# EAGLE schematic IR_CHR_LINSW_J002947Arevs (EAGLE 6.4), part 2 of 2
## Sheet 5 of 5
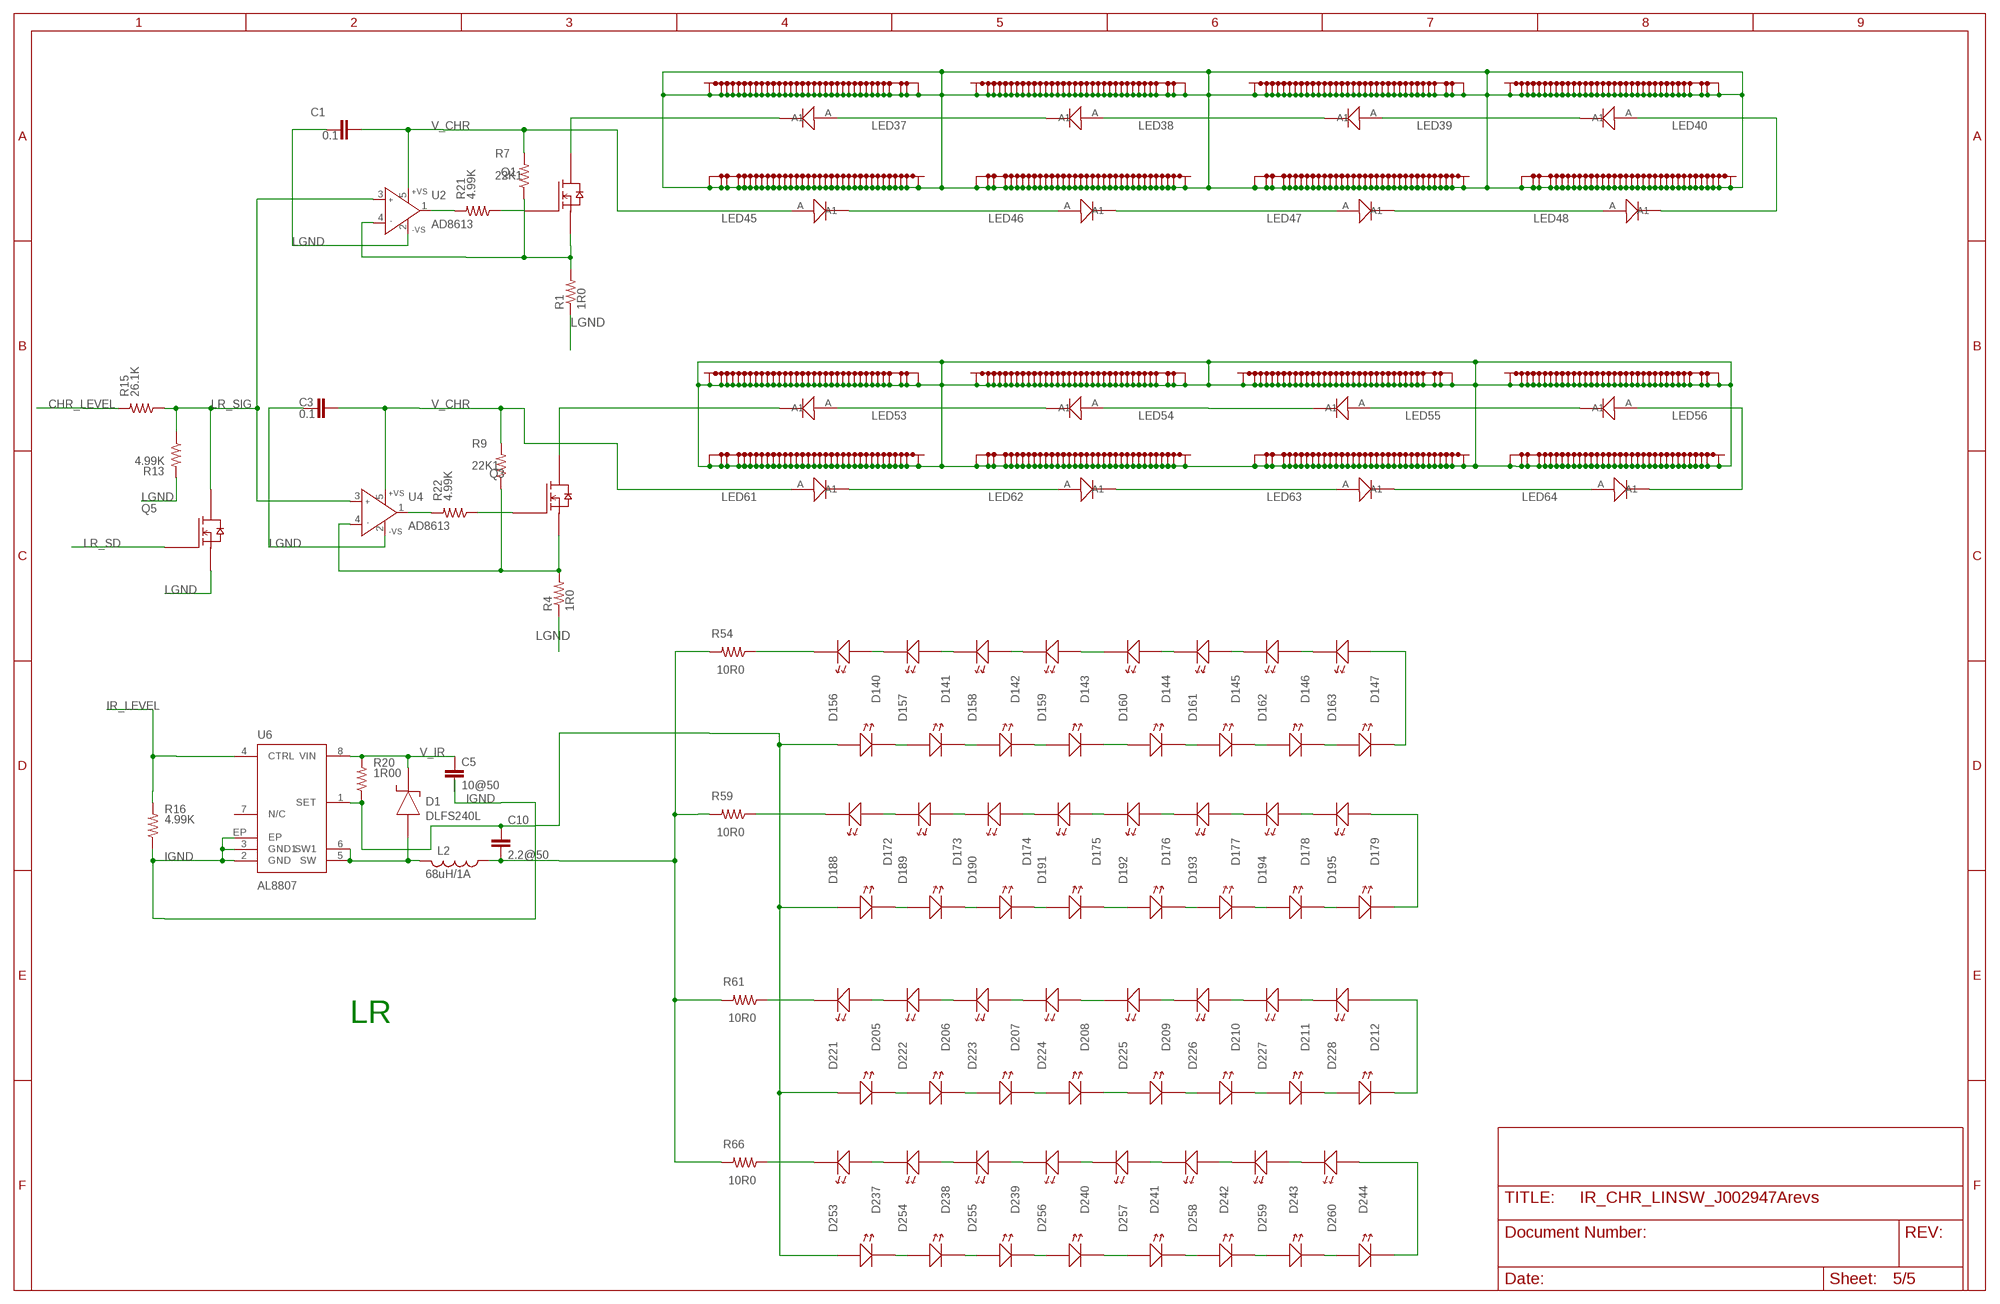
[diagram p4: schematic, sheet 5]

### Parts
C1  0.1  CAPS0603S  [0603S]
C3  0.1  CAPS0603S  [0603S]
C5  10@50  CAPS1206S  [1206S]
C10  2.2@50  CAPS1206S  [1206S]
D1  DLFS240L  DIODE_SCHOTTKYPWRDI-123  [PWRDI-123]
D140  LEDLED_SFH4050_HEAT  [LED_SFH4050_HEAT]
D141  LEDLED_SFH4050_HEAT  [LED_SFH4050_HEAT]
D142  LEDLED_SFH4050_HEAT  [LED_SFH4050_HEAT]
D143  LEDLED_SFH4050_HEAT  [LED_SFH4050_HEAT]
D144  LEDLED_SFH4050_HEAT  [LED_SFH4050_HEAT]
D145  LEDLED_SFH4050_HEAT  [LED_SFH4050_HEAT]
D146  LEDLED_SFH4050_HEAT  [LED_SFH4050_HEAT]
D147  LEDLED_SFH4050_HEAT  [LED_SFH4050_HEAT]
D156  LEDLED_SFH4050_HEAT  [LED_SFH4050_HEAT]
D157  LEDLED_SFH4050_HEAT  [LED_SFH4050_HEAT]
D158  LEDLED_SFH4050_HEAT  [LED_SFH4050_HEAT]
D159  LEDLED_SFH4050_HEAT  [LED_SFH4050_HEAT]
D160  LEDLED_SFH4050_HEAT  [LED_SFH4050_HEAT]
D161  LEDLED_SFH4050_HEAT  [LED_SFH4050_HEAT]
D162  LEDLED_SFH4050_HEAT  [LED_SFH4050_HEAT]
D163  LEDLED_SFH4050_HEAT  [LED_SFH4050_HEAT]
D172  LEDLED_SFH4050_HEAT  [LED_SFH4050_HEAT]
D173  LEDLED_SFH4050_HEAT  [LED_SFH4050_HEAT]
D174  LEDLED_SFH4050_HEAT  [LED_SFH4050_HEAT]
D175  LEDLED_SFH4050_HEAT  [LED_SFH4050_HEAT]
D176  LEDLED_SFH4050_HEAT  [LED_SFH4050_HEAT]
D177  LEDLED_SFH4050_HEAT  [LED_SFH4050_HEAT]
D178  LEDLED_SFH4050_HEAT  [LED_SFH4050_HEAT]
D179  LEDLED_SFH4050_HEAT  [LED_SFH4050_HEAT]
D188  LEDLED_SFH4050_HEAT  [LED_SFH4050_HEAT]
D189  LEDLED_SFH4050_HEAT  [LED_SFH4050_HEAT]
D190  LEDLED_SFH4050_HEAT  [LED_SFH4050_HEAT]
D191  LEDLED_SFH4050_HEAT  [LED_SFH4050_HEAT]
D192  LEDLED_SFH4050_HEAT  [LED_SFH4050_HEAT]
D193  LEDLED_SFH4050_HEAT  [LED_SFH4050_HEAT]
D194  LEDLED_SFH4050_HEAT  [LED_SFH4050_HEAT]
D195  LEDLED_SFH4050_HEAT  [LED_SFH4050_HEAT]
D205  LEDLED_SFH4050_HEAT  [LED_SFH4050_HEAT]
D206  LEDLED_SFH4050_HEAT  [LED_SFH4050_HEAT]
D207  LEDLED_SFH4050_HEAT  [LED_SFH4050_HEAT]
D208  LEDLED_SFH4050_HEAT  [LED_SFH4050_HEAT]
D209  LEDLED_SFH4050_HEAT  [LED_SFH4050_HEAT]
D210  LEDLED_SFH4050_HEAT  [LED_SFH4050_HEAT]
D211  LEDLED_SFH4050_HEAT  [LED_SFH4050_HEAT]
D212  LEDLED_SFH4050_HEAT  [LED_SFH4050_HEAT]
D221  LEDLED_SFH4050_HEAT  [LED_SFH4050_HEAT]
D222  LEDLED_SFH4050_HEAT  [LED_SFH4050_HEAT]
D223  LEDLED_SFH4050_HEAT  [LED_SFH4050_HEAT]
D224  LEDLED_SFH4050_HEAT  [LED_SFH4050_HEAT]
D225  LEDLED_SFH4050_HEAT  [LED_SFH4050_HEAT]
D226  LEDLED_SFH4050_HEAT  [LED_SFH4050_HEAT]
D227  LEDLED_SFH4050_HEAT  [LED_SFH4050_HEAT]
D228  LEDLED_SFH4050_HEAT  [LED_SFH4050_HEAT]
D237  LEDLED_SFH4050_HEAT  [LED_SFH4050_HEAT]
D238  LEDLED_SFH4050_HEAT  [LED_SFH4050_HEAT]
D239  LEDLED_SFH4050_HEAT  [LED_SFH4050_HEAT]
D240  LEDLED_SFH4050_HEAT  [LED_SFH4050_HEAT]
D241  LEDLED_SFH4050_HEAT  [LED_SFH4050_HEAT]
D242  LEDLED_SFH4050_HEAT  [LED_SFH4050_HEAT]
D243  LEDLED_SFH4050_HEAT  [LED_SFH4050_HEAT]
D244  LEDLED_SFH4050_HEAT  [LED_SFH4050_HEAT]
D253  LEDLED_SFH4050_HEAT  [LED_SFH4050_HEAT]
D254  LEDLED_SFH4050_HEAT  [LED_SFH4050_HEAT]
D255  LEDLED_SFH4050_HEAT  [LED_SFH4050_HEAT]
D256  LEDLED_SFH4050_HEAT  [LED_SFH4050_HEAT]
D257  LEDLED_SFH4050_HEAT  [LED_SFH4050_HEAT]
D258  LEDLED_SFH4050_HEAT  [LED_SFH4050_HEAT]
D259  LEDLED_SFH4050_HEAT  [LED_SFH4050_HEAT]
D260  LEDLED_SFH4050_HEAT  [LED_SFH4050_HEAT]
L2  68uH/1A  INDUCTOR_SMSRU8043  [SRU8043]
LED37  REBEL_0603OG_LED_W0603_EVEN_12  [OG_LED_W0603_EVEN_12]
LED38  REBEL_0603OG_LED_W0603_EVEN_12  [OG_LED_W0603_EVEN_12]
LED39  REBEL_0603OG_LED_W0603_EVEN_12  [OG_LED_W0603_EVEN_12]
LED40  REBEL_0603OG_LED_W0603_EVEN_12  [OG_LED_W0603_EVEN_12]
LED45  REBEL_0603OG_LED_W0603_EVEN_12  [OG_LED_W0603_EVEN_12]
LED46  REBEL_0603OG_LED_W0603_EVEN_12  [OG_LED_W0603_EVEN_12]
LED47  REBEL_0603OG_LED_W0603_EVEN_12  [OG_LED_W0603_EVEN_12]
LED48  REBEL_0603OG_LED_W0603_EVEN_12  [OG_LED_W0603_EVEN_12]
LED53  REBEL_0603OG_LED_W0603_EVEN_12  [OG_LED_W0603_EVEN_12]
LED54  REBEL_0603OG_LED_W0603_EVEN_12  [OG_LED_W0603_EVEN_12]
LED55  REBEL_0603OG_LED_W0603_EVEN_12  [OG_LED_W0603_EVEN_12]
LED56  REBEL_0603OG_LED_W0603_EVEN_12  [OG_LED_W0603_EVEN_12]
LED61  REBEL_0603OG_LED_W0603_EVEN_12  [OG_LED_W0603_EVEN_12]
LED62  REBEL_0603OG_LED_W0603_EVEN_12  [OG_LED_W0603_EVEN_12]
LED63  REBEL_0603OG_LED_W0603_EVEN_12  [OG_LED_W0603_EVEN_12]
LED64  REBEL_0603OG_LED_W0603_EVEN_12  [OG_LED_W0603_EVEN_12]
Q1  MOSFET-NTI252_HS  [TO252_HS]
Q3  MOSFET-NTI252_HS  [TO252_HS]
Q5  MOSFET-N  [SC-70]
R1  1R0  RESISTOR-POWER2512_HS1  [2512WIDE_HS1]
R4  1R0  RESISTOR-POWER2512_HS1  [2512WIDE_HS1]
R7  22K1  RESISTOR_SM0805S  [0805S]
R9  22K1  RESISTOR_SM0805S  [0805S]
R13  4.99K  RESISTOR_SM0603S  [0603S]
R15  26.1K  RESISTOR_SM0603S  [0603S]
R16  4.99K  RESISTOR_SM0805S  [0805S]
R20  1R00  RESISTOR_SM1206S  [1206S]
R21  4.99K  RESISTOR_SM0603S  [0603S]
R22  4.99K  RESISTOR_SM0603S  [0603S]
R54  10R0  RESISTOR_SM1206S  [1206S]
R59  10R0  RESISTOR_SM1206S  [1206S]
R61  10R0  RESISTOR_SM1206S  [1206S]
R66  10R0  RESISTOR_SM1206S  [1206S]
U2  AD8613  AD8065RT  [SOT23-5]
U4  AD8613  AD8065RT  [SOT23-5]
U6  AL8807  AD8807  [MSOP8-EP]

### Nets
CHR_LEVEL: R15.2 ; also sheet 1,2,3,4
IGND: C5.2 R16.1 U6.2(GND) U6.3(GND1) U6.EP ; also sheet 1,2,3,4
IR_DRV_LR: C10.1 D156.A D156.A1(A) D188.A D188.A1(A) D221.A D221.A1(A) D253.A D253.A1(A) R20.1 U6.1(SET)
IR_LEVEL: R16.2 U6.4(CTRL) ; also sheet 1,2,3,4
IR_RET_LR: C10.2 L2.1 R54.2 R59.2 R61.2 R66.2
LGND: C1.2 C3.2 Q5.2(S) R1.1 R1.1A R1.1A1 R1.1B R1.1B1 R1.1C R4.1 R4.1A R4.1A1 R4.1B R4.1B1 R4.1C R13.2 U2.2(-VS) U4.2(-VS) ; also sheet 1,2,3,4
LR_SD: Q5.1(G) ; also sheet 1
LR_SIG: Q5.3(D) R13.1 R15.1 U2.3(IN+) U4.3(IN+)
N$88: D1.A L2.2 U6.5(SW) U6.6(SW1)
N$138: Q1.1(G) R21.1
N$140: R21.2 U2.1(OUT)
N$174: Q3.2(S) R4.2 R9.1 U4.4(IN-)
N$184: R22.2 U4.1(OUT)
N$185: Q1.2(S) R1.2 R7.1 U2.4(IN-)
N$186: Q3.1(G) R22.1
N$504: D211.A D211.A1(A) D212.C1(K) D212.C(K)
N$505: D210.A D210.A1(A) D211.C1(K) D211.C(K)
N$506: D209.A D209.A1(A) D210.C1(K) D210.C(K)
N$507: D207.A D207.A1(A) D208.C1(K) D208.C(K)
N$508: D206.A D206.A1(A) D207.C1(K) D207.C(K)
N$509: D205.A D205.A1(A) D206.C1(K) D206.C(K)
N$510: D221.C1(K) D221.C(K) D222.A D222.A1(A)
N$511: D243.A D243.A1(A) D244.C1(K) D244.C(K)
N$512: D242.A D242.A1(A) D243.C1(K) D243.C(K)
N$513: D241.A D241.A1(A) D242.C1(K) D242.C(K)
N$514: D240.A D240.A1(A) D241.C1(K) D241.C(K)
N$515: D239.A D239.A1(A) D240.C1(K) D240.C(K)
N$516: D238.A D238.A1(A) D239.C1(K) D239.C(K)
N$517: D237.A D237.A1(A) D238.C1(K) D238.C(K)
N$518: D225.C1(K) D225.C(K) D226.A D226.A1(A)
N$519: D226.C1(K) D226.C(K) D227.A D227.A1(A)
N$520: D227.C1(K) D227.C(K) D228.A D228.A1(A)
N$521: D253.C1(K) D253.C(K) D254.A D254.A1(A)
N$522: D255.C1(K) D255.C(K) D256.A D256.A1(A)
N$523: D257.C1(K) D257.C(K) D258.A D258.A1(A)
N$524: D258.C1(K) D258.C(K) D259.A D259.A1(A)
N$525: D259.C1(K) D259.C(K) D260.A D260.A1(A)
N$526: D212.A D212.A1(A) D228.C1(K) D228.C(K)
N$527: D256.C1(K) D256.C(K) D257.A D257.A1(A)
N$528: D244.A D244.A1(A) D260.C1(K) D260.C(K)
N$531: D178.A D178.A1(A) D179.C1(K) D179.C(K)
N$532: D175.A D175.A1(A) D176.C1(K) D176.C(K)
N$533: D174.A D174.A1(A) D175.C1(K) D175.C(K)
N$534: D173.A D173.A1(A) D174.C1(K) D174.C(K)
N$535: D172.A D172.A1(A) D173.C1(K) D173.C(K)
N$536: D160.C1(K) D160.C(K) D161.A D161.A1(A)
N$538: D188.C1(K) D188.C(K) D189.A D189.A1(A)
N$539: D146.A D146.A1(A) D147.C1(K) D147.C(K)
N$540: D145.A D145.A1(A) D146.C1(K) D146.C(K)
N$541: D144.A D144.A1(A) D145.C1(K) D145.C(K)
N$542: D142.A D142.A1(A) D143.C1(K) D143.C(K)
N$543: D141.A D141.A1(A) D142.C1(K) D142.C(K)
N$544: D159.C1(K) D159.C(K) D160.A D160.A1(A)
N$545: D147.A D147.A1(A) D163.C1(K) D163.C(K)
N$546: D157.C1(K) D157.C(K) D158.A D158.A1(A)
N$547: D179.A D179.A1(A) D195.C1(K) D195.C(K)
N$549: D176.A D176.A1(A) D177.C1(K) D177.C(K)
N$550: D254.C1(K) D254.C(K) D255.A D255.A1(A)
N$551: D224.C1(K) D224.C(K) D225.A D225.A1(A)
N$552: D162.C1(K) D162.C(K) D163.A D163.A1(A)
N$554: D208.A D208.A1(A) D209.C1(K) D209.C(K)
N$555: LED63.C(K1) LED64.A(A1)
N$556: LED56.A(A1) LED64.C(K1)
N$559: LED53.A(A1) LED54.C(K1)
N$560: LED54.A(A1) LED55.C(K1)
N$561: LED55.A(A1) LED56.C(K1)
N$562: LED47.C(K1) LED48.A(A1)
N$563: LED40.A(A1) LED48.C(K1)
N$564: LED46.C(K1) LED47.A(A1)
N$565: LED45.C(K1) LED46.A(A1)
N$567: LED38.A(A1) LED39.C(K1)
N$570: D140.C1(K) D140.C(K) R54.1
N$571: D172.C1(K) D172.C(K) R59.1
N$574: D205.C1(K) D205.C(K) R61.1
N$577: D237.C1(K) D237.C(K) R66.1
N$578: D222.C1(K) D222.C(K) D223.A D223.A1(A)
N$579: D223.C1(K) D223.C(K) D224.A D224.A1(A)
N$580: D177.A D177.A1(A) D178.C1(K) D178.C(K)
N$581: D161.C1(K) D161.C(K) D162.A D162.A1(A)
N$582: D143.A D143.A1(A) D144.C1(K) D144.C(K)
N$583: D140.A D140.A1(A) D141.C1(K) D141.C(K)
N$584: D156.C1(K) D156.C(K) D157.A D157.A1(A)
N$585: D158.C1(K) D158.C(K) D159.A D159.A1(A)
N$586: D189.C1(K) D189.C(K) D190.A D190.A1(A)
N$587: D190.C1(K) D190.C(K) D191.A D191.A1(A)
N$588: D191.C1(K) D191.C(K) D192.A D192.A1(A)
N$589: D192.C1(K) D192.C(K) D193.A D193.A1(A)
N$590: D193.C1(K) D193.C(K) D194.A D194.A1(A)
N$591: D194.C1(K) D194.C(K) D195.A D195.A1(A)
N$592: LED62.C(K1) LED63.A(A1)
N$593: LED61.C(K1) LED62.A(A1)
N$594: LED37.A(A1) LED38.C(K1)
N$595: LED39.A(A1) LED40.C(K1)
Q2: LED53.C(K1) Q3.3(D) Q3.3S(D) Q3.P$1(D) Q3.P$2(D) Q3.P$3(D) Q3.P$4(D) Q3.P$5(D) Q3.P$6(D) Q3.P$7(D) Q3.P$8(D) Q3.P$9(D) Q3.P$10(D) Q3.P$11(D) Q3.P$12(D)
Q4: LED37.C(K1) Q1.3(D) Q1.3S(D) Q1.P$1(D) Q1.P$2(D) Q1.P$3(D) Q1.P$4(D) Q1.P$5(D) Q1.P$6(D) Q1.P$7(D) Q1.P$8(D) Q1.P$9(D) Q1.P$10(D) Q1.P$11(D) Q1.P$12(D)
TH: LED37.TH1(TH) LED37.TH@38(TH) LED37.TH@39(TH) LED37.TH@40(TH) LED37.TH@41(TH) LED37.TH@42(TH) LED37.TH@43(TH) LED37.TH@44(TH) LED37.TH@45(TH) LED37.TH@46(TH) LED37.TH@47(TH) LED37.TH@48(TH) LED37.TH@49(TH) LED37.TH@50(TH) LED37.TH@51(TH) LED37.TH@52(TH) LED37.TH@53(TH) LED37.TH@54(TH) LED37.TH@55(TH) LED37.TH@56(TH) LED37.TH@57(TH) LED37.TH@58(TH) LED37.TH@59(TH) LED37.TH@60(TH) LED37.TH@61(TH) LED37.TH@62(TH) LED37.TH@63(TH) LED37.TH@64(TH) LED37.TH@65(TH) LED37.TH@66(TH) LED37.TH@67(TH) LED37.TH@68(TH) LED37.TH@69(TH) LED37.TH@70(TH) LED38.TH1(TH) LED38.TH@38(TH) LED38.TH@39(TH) LED38.TH@40(TH) LED38.TH@41(TH) LED38.TH@42(TH) LED38.TH@43(TH) LED38.TH@44(TH) LED38.TH@45(TH) LED38.TH@46(TH) LED38.TH@47(TH) LED38.TH@48(TH) LED38.TH@49(TH) LED38.TH@50(TH) LED38.TH@51(TH) LED38.TH@52(TH) LED38.TH@53(TH) LED38.TH@54(TH) LED38.TH@55(TH) LED38.TH@56(TH) LED38.TH@57(TH) LED38.TH@58(TH) LED38.TH@59(TH) LED38.TH@60(TH) LED38.TH@61(TH) LED38.TH@62(TH) LED38.TH@63(TH) LED38.TH@64(TH) LED38.TH@65(TH) LED38.TH@66(TH) LED38.TH@67(TH) LED38.TH@68(TH) LED38.TH@69(TH) LED38.TH@70(TH) LED39.TH1(TH) LED39.TH@38(TH) LED39.TH@39(TH) LED39.TH@40(TH) LED39.TH@41(TH) LED39.TH@42(TH) LED39.TH@43(TH) LED39.TH@44(TH) LED39.TH@45(TH) LED39.TH@46(TH) LED39.TH@47(TH) LED39.TH@48(TH) LED39.TH@49(TH) LED39.TH@50(TH) LED39.TH@51(TH) LED39.TH@52(TH) LED39.TH@53(TH) LED39.TH@54(TH) LED39.TH@55(TH) LED39.TH@56(TH) LED39.TH@57(TH) LED39.TH@58(TH) LED39.TH@59(TH) LED39.TH@60(TH) LED39.TH@61(TH) LED39.TH@62(TH) LED39.TH@63(TH) LED39.TH@64(TH) LED39.TH@65(TH) LED39.TH@66(TH) LED39.TH@67(TH) LED39.TH@68(TH) LED39.TH@69(TH) LED39.TH@70(TH) LED40.TH1(TH) LED40.TH@38(TH) LED40.TH@39(TH) LED40.TH@40(TH) LED40.TH@41(TH) LED40.TH@42(TH) LED40.TH@43(TH) LED40.TH@44(TH) LED40.TH@45(TH) LED40.TH@46(TH) LED40.TH@47(TH) LED40.TH@48(TH) LED40.TH@49(TH) LED40.TH@50(TH) LED40.TH@51(TH) LED40.TH@52(TH) LED40.TH@53(TH) LED40.TH@54(TH) LED40.TH@55(TH) LED40.TH@56(TH) LED40.TH@57(TH) LED40.TH@58(TH) LED40.TH@59(TH) LED40.TH@60(TH) LED40.TH@61(TH) LED40.TH@62(TH) LED40.TH@63(TH) LED40.TH@64(TH) LED40.TH@65(TH) LED40.TH@66(TH) LED40.TH@67(TH) LED40.TH@68(TH) LED40.TH@69(TH) LED40.TH@70(TH) LED45.TH1(TH) LED45.TH@38(TH) LED45.TH@39(TH) LED45.TH@40(TH) LED45.TH@41(TH) LED45.TH@42(TH) LED45.TH@43(TH) LED45.TH@44(TH) LED45.TH@45(TH) LED45.TH@46(TH) LED45.TH@47(TH) LED45.TH@48(TH) LED45.TH@49(TH) LED45.TH@50(TH) LED45.TH@51(TH) LED45.TH@52(TH) LED45.TH@53(TH) LED45.TH@54(TH) LED45.TH@55(TH) LED45.TH@56(TH) LED45.TH@57(TH) LED45.TH@58(TH) LED45.TH@59(TH) LED45.TH@60(TH) LED45.TH@61(TH) LED45.TH@62(TH) LED45.TH@63(TH) LED45.TH@64(TH) LED45.TH@65(TH) LED45.TH@66(TH) LED45.TH@67(TH) LED45.TH@68(TH) LED45.TH@69(TH) LED45.TH@70(TH) LED46.TH1(TH) LED46.TH@38(TH) LED46.TH@39(TH) LED46.TH@40(TH) LED46.TH@41(TH) LED46.TH@42(TH) LED46.TH@43(TH) LED46.TH@44(TH) LED46.TH@45(TH) LED46.TH@46(TH) LED46.TH@47(TH) LED46.TH@48(TH) LED46.TH@49(TH) LED46.TH@50(TH) LED46.TH@51(TH) LED46.TH@52(TH) LED46.TH@53(TH) LED46.TH@54(TH) LED46.TH@55(TH) LED46.TH@56(TH) LED46.TH@57(TH) LED46.TH@58(TH) LED46.TH@59(TH) LED46.TH@60(TH) LED46.TH@61(TH) LED46.TH@62(TH) LED46.TH@63(TH) LED46.TH@64(TH) LED46.TH@65(TH) LED46.TH@66(TH) LED46.TH@67(TH) LED46.TH@68(TH) LED46.TH@69(TH) LED46.TH@70(TH) LED47.TH1(TH) LED47.TH@38(TH) LED47.TH@39(TH) LED47.TH@40(TH) LED47.TH@41(TH) LED47.TH@42(TH) LED47.TH@43(TH) LED47.TH@44(TH) LED47.TH@45(TH) LED47.TH@46(TH) LED47.TH@47(TH) LED47.TH@48(TH) LED47.TH@49(TH) LED47.TH@50(TH) LED47.TH@51(TH) LED47.TH@52(TH) LED47.TH@53(TH) LED47.TH@54(TH) LED47.TH@55(TH) LED47.TH@56(TH) LED47.TH@57(TH) LED47.TH@58(TH) LED47.TH@59(TH) LED47.TH@60(TH) LED47.TH@61(TH) LED47.TH@62(TH) LED47.TH@63(TH) LED47.TH@64(TH) LED47.TH@65(TH) LED47.TH@66(TH) LED47.TH@67(TH) LED47.TH@68(TH) LED47.TH@69(TH) LED47.TH@70(TH) LED48.TH1(TH) LED48.TH@38(TH) LED48.TH@39(TH) LED48.TH@40(TH) LED48.TH@41(TH) LED48.TH@42(TH) LED48.TH@43(TH) LED48.TH@44(TH) LED48.TH@45(TH) LED48.TH@46(TH) LED48.TH@47(TH) LED48.TH@48(TH) LED48.TH@49(TH) LED48.TH@50(TH) LED48.TH@51(TH) LED48.TH@52(TH) LED48.TH@53(TH) LED48.TH@54(TH) LED48.TH@55(TH) LED48.TH@56(TH) LED48.TH@57(TH) LED48.TH@58(TH) LED48.TH@59(TH) LED48.TH@60(TH) LED48.TH@61(TH) LED48.TH@62(TH) LED48.TH@63(TH) LED48.TH@64(TH) LED48.TH@65(TH) LED48.TH@66(TH) LED48.TH@67(TH) LED48.TH@68(TH) LED48.TH@69(TH) LED48.TH@70(TH) LED53.TH1(TH) LED53.TH@38(TH) LED53.TH@39(TH) LED53.TH@40(TH) LED53.TH@41(TH) LED53.TH@42(TH) LED53.TH@43(TH) LED53.TH@44(TH) LED53.TH@45(TH) LED53.TH@46(TH) LED53.TH@47(TH) LED53.TH@48(TH) LED53.TH@49(TH) LED53.TH@50(TH) LED53.TH@51(TH) LED53.TH@52(TH) LED53.TH@53(TH) LED53.TH@54(TH) LED53.TH@55(TH) LED53.TH@56(TH) LED53.TH@57(TH) LED53.TH@58(TH) LED53.TH@59(TH) LED53.TH@60(TH) LED53.TH@61(TH) LED53.TH@62(TH) LED53.TH@63(TH) LED53.TH@64(TH) LED53.TH@65(TH) LED53.TH@66(TH) LED53.TH@67(TH) LED53.TH@68(TH) LED53.TH@69(TH) LED53.TH@70(TH) LED54.TH1(TH) LED54.TH@38(TH) LED54.TH@39(TH) LED54.TH@40(TH) LED54.TH@41(TH) LED54.TH@42(TH) LED54.TH@43(TH) LED54.TH@44(TH) LED54.TH@45(TH) LED54.TH@46(TH) LED54.TH@47(TH) LED54.TH@48(TH) LED54.TH@49(TH) LED54.TH@50(TH) LED54.TH@51(TH) LED54.TH@52(TH) LED54.TH@53(TH) LED54.TH@54(TH) LED54.TH@55(TH) LED54.TH@56(TH) LED54.TH@57(TH) LED54.TH@58(TH) LED54.TH@59(TH) LED54.TH@60(TH) LED54.TH@61(TH) LED54.TH@62(TH) LED54.TH@63(TH) LED54.TH@64(TH) LED54.TH@65(TH) LED54.TH@66(TH) LED54.TH@67(TH) LED54.TH@68(TH) LED54.TH@69(TH) LED54.TH@70(TH) LED55.TH1(TH) LED55.TH@38(TH) LED55.TH@39(TH) LED55.TH@40(TH) LED55.TH@41(TH) LED55.TH@42(TH) LED55.TH@43(TH) LED55.TH@44(TH) LED55.TH@45(TH) LED55.TH@46(TH) LED55.TH@47(TH) LED55.TH@48(TH) LED55.TH@49(TH) LED55.TH@50(TH) LED55.TH@51(TH) LED55.TH@52(TH) LED55.TH@53(TH) LED55.TH@54(TH) LED55.TH@55(TH) LED55.TH@56(TH) LED55.TH@57(TH) LED55.TH@58(TH) LED55.TH@59(TH) LED55.TH@60(TH) LED55.TH@61(TH) LED55.TH@62(TH) LED55.TH@63(TH) LED55.TH@64(TH) LED55.TH@65(TH) LED55.TH@66(TH) LED55.TH@67(TH) LED55.TH@68(TH) LED55.TH@69(TH) LED55.TH@70(TH) LED56.TH1(TH) LED56.TH@38(TH) LED56.TH@39(TH) LED56.TH@40(TH) LED56.TH@41(TH) LED56.TH@42(TH) LED56.TH@43(TH) LED56.TH@44(TH) LED56.TH@45(TH) LED56.TH@46(TH) LED56.TH@47(TH) LED56.TH@48(TH) LED56.TH@49(TH) LED56.TH@50(TH) LED56.TH@51(TH) LED56.TH@52(TH) LED56.TH@53(TH) LED56.TH@54(TH) LED56.TH@55(TH) LED56.TH@56(TH) LED56.TH@57(TH) LED56.TH@58(TH) LED56.TH@59(TH) LED56.TH@60(TH) LED56.TH@61(TH) LED56.TH@62(TH) LED56.TH@63(TH) LED56.TH@64(TH) LED56.TH@65(TH) LED56.TH@66(TH) LED56.TH@67(TH) LED56.TH@68(TH) LED56.TH@69(TH) LED56.TH@70(TH) LED61.TH1(TH) LED61.TH@38(TH) LED61.TH@39(TH) LED61.TH@40(TH) LED61.TH@41(TH) LED61.TH@42(TH) LED61.TH@43(TH) LED61.TH@44(TH) LED61.TH@45(TH) LED61.TH@46(TH) LED61.TH@47(TH) LED61.TH@48(TH) LED61.TH@49(TH) LED61.TH@50(TH) LED61.TH@51(TH) LED61.TH@52(TH) LED61.TH@53(TH) LED61.TH@54(TH) LED61.TH@55(TH) LED61.TH@56(TH) LED61.TH@57(TH) LED61.TH@58(TH) LED61.TH@59(TH) LED61.TH@60(TH) LED61.TH@61(TH) LED61.TH@62(TH) LED61.TH@63(TH) LED61.TH@64(TH) LED61.TH@65(TH) LED61.TH@66(TH) LED61.TH@67(TH) LED61.TH@68(TH) LED61.TH@69(TH) LED61.TH@70(TH) LED62.TH1(TH) LED62.TH@38(TH) LED62.TH@39(TH) LED62.TH@40(TH) LED62.TH@41(TH) LED62.TH@42(TH) LED62.TH@43(TH) LED62.TH@44(TH) LED62.TH@45(TH) LED62.TH@46(TH) LED62.TH@47(TH) LED62.TH@48(TH) LED62.TH@49(TH) LED62.TH@50(TH) LED62.TH@51(TH) LED62.TH@52(TH) LED62.TH@53(TH) LED62.TH@54(TH) LED62.TH@55(TH) LED62.TH@56(TH) LED62.TH@57(TH) LED62.TH@58(TH) LED62.TH@59(TH) LED62.TH@60(TH) LED62.TH@61(TH) LED62.TH@62(TH) LED62.TH@63(TH) LED62.TH@64(TH) LED62.TH@65(TH) LED62.TH@66(TH) LED62.TH@67(TH) LED62.TH@68(TH) LED62.TH@69(TH) LED62.TH@70(TH) LED63.TH1(TH) LED63.TH@38(TH) LED63.TH@39(TH) LED63.TH@40(TH) LED63.TH@41(TH) LED63.TH@42(TH) LED63.TH@43(TH) LED63.TH@44(TH) LED63.TH@45(TH) LED63.TH@46(TH) LED63.TH@47(TH) LED63.TH@48(TH) LED63.TH@49(TH) LED63.TH@50(TH) LED63.TH@51(TH) LED63.TH@52(TH) LED63.TH@53(TH) LED63.TH@54(TH) LED63.TH@55(TH) LED63.TH@56(TH) LED63.TH@57(TH) LED63.TH@58(TH) LED63.TH@59(TH) LED63.TH@60(TH) LED63.TH@61(TH) LED63.TH@62(TH) LED63.TH@63(TH) LED63.TH@64(TH) LED63.TH@65(TH) LED63.TH@66(TH) LED63.TH@67(TH) LED63.TH@68(TH) LED63.TH@69(TH) LED63.TH@70(TH) LED64.TH1(TH) LED64.TH@38(TH) LED64.TH@39(TH) LED64.TH@40(TH) LED64.TH@41(TH) LED64.TH@42(TH) LED64.TH@43(TH) LED64.TH@44(TH) LED64.TH@45(TH) LED64.TH@46(TH) LED64.TH@47(TH) LED64.TH@48(TH) LED64.TH@49(TH) LED64.TH@50(TH) LED64.TH@51(TH) LED64.TH@52(TH) LED64.TH@53(TH) LED64.TH@54(TH) LED64.TH@55(TH) LED64.TH@56(TH) LED64.TH@57(TH) LED64.TH@58(TH) LED64.TH@59(TH) LED64.TH@60(TH) LED64.TH@61(TH) LED64.TH@62(TH) LED64.TH@63(TH) LED64.TH@64(TH) LED64.TH@65(TH) LED64.TH@66(TH) LED64.TH@67(TH) LED64.TH@68(TH) LED64.TH@69(TH) LED64.TH@70(TH) ; also sheet 2,3,4
V_CHR: C1.1 C3.1 LED45.A(A1) LED61.A(A1) R7.2 R9.2 U2.5(+VS) U4.5(+VS) ; also sheet 1,2,3,4
V_IR: C5.1 D1.K R20.2 U6.8(VIN) ; also sheet 1,2,3,4
Unconnected: U6.7(N/C)

### Notes on the sheet
- LR

## Power pins joined to a net without a drawn wire
TH: LED1.TH@38(TH) LED1.TH@39(TH) LED1.TH@40(TH) LED1.TH@41(TH) LED1.TH@42(TH) LED1.TH@43(TH) LED1.TH@44(TH) LED1.TH@45(TH) LED1.TH@46(TH) LED1.TH@47(TH) LED1.TH@48(TH) LED1.TH@49(TH) LED1.TH@50(TH) LED1.TH@51(TH) LED1.TH@52(TH) LED1.TH@53(TH) LED1.TH@54(TH) LED1.TH@55(TH) LED1.TH@56(TH) LED1.TH@57(TH) LED1.TH@58(TH) LED1.TH@59(TH) LED1.TH@60(TH) LED1.TH@61(TH) LED1.TH@62(TH) LED1.TH@63(TH) LED1.TH@64(TH) LED1.TH@65(TH) LED1.TH@66(TH) LED1.TH@67(TH) LED1.TH@68(TH) LED1.TH@69(TH) LED1.TH@70(TH) LED2.TH@38(TH) LED2.TH@39(TH) LED2.TH@40(TH) LED2.TH@41(TH) LED2.TH@42(TH) LED2.TH@43(TH) LED2.TH@44(TH) LED2.TH@45(TH) LED2.TH@46(TH) LED2.TH@47(TH) LED2.TH@48(TH) LED2.TH@49(TH) LED2.TH@50(TH) LED2.TH@51(TH) LED2.TH@52(TH) LED2.TH@53(TH) LED2.TH@54(TH) LED2.TH@55(TH) LED2.TH@56(TH) LED2.TH@57(TH) LED2.TH@58(TH) LED2.TH@59(TH) LED2.TH@60(TH) LED2.TH@61(TH) LED2.TH@62(TH) LED2.TH@63(TH) LED2.TH@64(TH) LED2.TH@65(TH) LED2.TH@66(TH) LED2.TH@67(TH) LED2.TH@68(TH) LED2.TH@69(TH) LED2.TH@70(TH) LED3.TH1(TH) LED3.TH@38(TH) LED3.TH@39(TH) LED3.TH@40(TH) LED3.TH@41(TH) LED3.TH@42(TH) LED3.TH@43(TH) LED3.TH@44(TH) LED3.TH@45(TH) LED3.TH@46(TH) LED3.TH@47(TH) LED3.TH@48(TH) LED3.TH@49(TH) LED3.TH@50(TH) LED3.TH@51(TH) LED3.TH@52(TH) LED3.TH@53(TH) LED3.TH@54(TH) LED3.TH@55(TH) LED3.TH@56(TH) LED3.TH@57(TH) LED3.TH@58(TH) LED3.TH@59(TH) LED3.TH@60(TH) LED3.TH@61(TH) LED3.TH@62(TH) LED3.TH@63(TH) LED3.TH@64(TH) LED3.TH@65(TH) LED3.TH@66(TH) LED3.TH@67(TH) LED3.TH@69(TH) LED3.TH@70(TH) LED4.TH1(TH) LED4.TH@38(TH) LED4.TH@39(TH) LED4.TH@40(TH) LED4.TH@41(TH) LED4.TH@42(TH) LED4.TH@43(TH) LED4.TH@44(TH) LED4.TH@45(TH) LED4.TH@46(TH) LED4.TH@47(TH) LED4.TH@48(TH) LED4.TH@49(TH) LED4.TH@50(TH) LED4.TH@51(TH) LED4.TH@52(TH) LED4.TH@53(TH) LED4.TH@54(TH) LED4.TH@55(TH) LED4.TH@56(TH) LED4.TH@57(TH) LED4.TH@58(TH) LED4.TH@59(TH) LED4.TH@60(TH) LED4.TH@61(TH) LED4.TH@62(TH) LED4.TH@63(TH) LED4.TH@64(TH) LED4.TH@65(TH) LED4.TH@66(TH) LED4.TH@67(TH) LED4.TH@69(TH) LED4.TH@70(TH) LED5.TH@38(TH) LED5.TH@39(TH) LED5.TH@40(TH) LED5.TH@41(TH) LED5.TH@42(TH) LED5.TH@43(TH) LED5.TH@44(TH) LED5.TH@45(TH) LED5.TH@46(TH) LED5.TH@47(TH) LED5.TH@48(TH) LED5.TH@49(TH) LED5.TH@50(TH) LED5.TH@51(TH) LED5.TH@52(TH) LED5.TH@53(TH) LED5.TH@54(TH) LED5.TH@55(TH) LED5.TH@56(TH) LED5.TH@57(TH) LED5.TH@58(TH) LED5.TH@59(TH) LED5.TH@60(TH) LED5.TH@61(TH) LED5.TH@62(TH) LED5.TH@63(TH) LED5.TH@64(TH) LED5.TH@65(TH) LED5.TH@66(TH) LED5.TH@67(TH) LED5.TH@69(TH) LED5.TH@70(TH) LED6.TH@38(TH) LED6.TH@39(TH) LED6.TH@40(TH) LED6.TH@41(TH) LED6.TH@42(TH) LED6.TH@43(TH) LED6.TH@44(TH) LED6.TH@45(TH) LED6.TH@46(TH) LED6.TH@47(TH) LED6.TH@48(TH) LED6.TH@49(TH) LED6.TH@50(TH) LED6.TH@51(TH) LED6.TH@52(TH) LED6.TH@53(TH) LED6.TH@54(TH) LED6.TH@55(TH) LED6.TH@56(TH) LED6.TH@57(TH) LED6.TH@58(TH) LED6.TH@59(TH) LED6.TH@60(TH) LED6.TH@61(TH) LED6.TH@62(TH) LED6.TH@63(TH) LED6.TH@64(TH) LED6.TH@65(TH) LED6.TH@66(TH) LED6.TH@67(TH) LED6.TH@69(TH) LED6.TH@70(TH) LED7.TH@38(TH) LED7.TH@39(TH) LED7.TH@40(TH) LED7.TH@41(TH) LED7.TH@42(TH) LED7.TH@43(TH) LED7.TH@44(TH) LED7.TH@45(TH) LED7.TH@46(TH) LED7.TH@47(TH) LED7.TH@48(TH) LED7.TH@49(TH) LED7.TH@50(TH) LED7.TH@51(TH) LED7.TH@52(TH) LED7.TH@53(TH) LED7.TH@54(TH) LED7.TH@55(TH) LED7.TH@56(TH) LED7.TH@57(TH) LED7.TH@58(TH) LED7.TH@59(TH) LED7.TH@60(TH) LED7.TH@61(TH) LED7.TH@62(TH) LED7.TH@63(TH) LED7.TH@64(TH) LED7.TH@65(TH) LED7.TH@66(TH) LED7.TH@67(TH) LED7.TH@69(TH) LED7.TH@70(TH) LED8.TH@38(TH) LED8.TH@39(TH) LED8.TH@40(TH) LED8.TH@41(TH) LED8.TH@42(TH) LED8.TH@43(TH) LED8.TH@44(TH) LED8.TH@45(TH) LED8.TH@46(TH) LED8.TH@47(TH) LED8.TH@48(TH) LED8.TH@49(TH) LED8.TH@50(TH) LED8.TH@51(TH) LED8.TH@52(TH) LED8.TH@53(TH) LED8.TH@54(TH) LED8.TH@55(TH) LED8.TH@56(TH) LED8.TH@57(TH) LED8.TH@58(TH) LED8.TH@59(TH) LED8.TH@60(TH) LED8.TH@61(TH) LED8.TH@62(TH) LED8.TH@63(TH) LED8.TH@64(TH) LED8.TH@65(TH) LED8.TH@66(TH) LED8.TH@67(TH) LED8.TH@69(TH) LED8.TH@70(TH) LED9.TH1(TH) LED9.TH@38(TH) LED9.TH@39(TH) LED9.TH@40(TH) LED9.TH@41(TH) LED9.TH@42(TH) LED9.TH@43(TH) LED9.TH@44(TH) LED9.TH@45(TH) LED9.TH@46(TH) LED9.TH@47(TH) LED9.TH@48(TH) LED9.TH@49(TH) LED9.TH@50(TH) LED9.TH@51(TH) LED9.TH@52(TH) LED9.TH@53(TH) LED9.TH@54(TH) LED9.TH@55(TH) LED9.TH@56(TH) LED9.TH@57(TH) LED9.TH@58(TH) LED9.TH@59(TH) LED9.TH@60(TH) LED9.TH@61(TH) LED9.TH@62(TH) LED9.TH@63(TH) LED9.TH@64(TH) LED9.TH@65(TH) LED9.TH@66(TH) LED9.TH@67(TH) LED9.TH@69(TH) LED9.TH@70(TH) LED10.TH1(TH) LED10.TH@38(TH) LED10.TH@39(TH) LED10.TH@40(TH) LED10.TH@41(TH) LED10.TH@42(TH) LED10.TH@43(TH) LED10.TH@44(TH) LED10.TH@45(TH) LED10.TH@46(TH) LED10.TH@47(TH) LED10.TH@48(TH) LED10.TH@49(TH) LED10.TH@50(TH) LED10.TH@51(TH) LED10.TH@52(TH) LED10.TH@53(TH) LED10.TH@54(TH) LED10.TH@55(TH) LED10.TH@56(TH) LED10.TH@57(TH) LED10.TH@58(TH) LED10.TH@59(TH) LED10.TH@60(TH) LED10.TH@61(TH) LED10.TH@62(TH) LED10.TH@63(TH) LED10.TH@64(TH) LED10.TH@65(TH) LED10.TH@66(TH) LED10.TH@67(TH) LED10.TH@69(TH) LED10.TH@70(TH) LED11.TH@38(TH) LED11.TH@39(TH) LED11.TH@40(TH) LED11.TH@41(TH) LED11.TH@42(TH) LED11.TH@43(TH) LED11.TH@44(TH) LED11.TH@45(TH) LED11.TH@46(TH) LED11.TH@47(TH) LED11.TH@48(TH) LED11.TH@49(TH) LED11.TH@50(TH) LED11.TH@51(TH) LED11.TH@52(TH) LED11.TH@53(TH) LED11.TH@54(TH) LED11.TH@55(TH) LED11.TH@56(TH) LED11.TH@57(TH) LED11.TH@58(TH) LED11.TH@59(TH) LED11.TH@60(TH) LED11.TH@61(TH) LED11.TH@62(TH) LED11.TH@63(TH) LED11.TH@64(TH) LED11.TH@65(TH) LED11.TH@66(TH) LED11.TH@67(TH) LED11.TH@68(TH) LED11.TH@69(TH) LED11.TH@70(TH) LED12.TH@38(TH) LED12.TH@39(TH) LED12.TH@40(TH) LED12.TH@41(TH) LED12.TH@42(TH) LED12.TH@43(TH) LED12.TH@44(TH) LED12.TH@45(TH) LED12.TH@46(TH) LED12.TH@47(TH) LED12.TH@48(TH) LED12.TH@49(TH) LED12.TH@50(TH) LED12.TH@51(TH) LED12.TH@52(TH) LED12.TH@53(TH) LED12.TH@54(TH) LED12.TH@55(TH) LED12.TH@56(TH) LED12.TH@57(TH) LED12.TH@58(TH) LED12.TH@59(TH) LED12.TH@60(TH) LED12.TH@61(TH) LED12.TH@62(TH) LED12.TH@63(TH) LED12.TH@64(TH) LED12.TH@65(TH) LED12.TH@66(TH) LED12.TH@67(TH) LED12.TH@68(TH) LED12.TH@69(TH) LED12.TH@70(TH) LED13.TH@38(TH) LED13.TH@39(TH) LED13.TH@40(TH) LED13.TH@41(TH) LED13.TH@42(TH) LED13.TH@43(TH) LED13.TH@44(TH) LED13.TH@45(TH) LED13.TH@46(TH) LED13.TH@47(TH) LED13.TH@48(TH) LED13.TH@49(TH) LED13.TH@50(TH) LED13.TH@51(TH) LED13.TH@52(TH) LED13.TH@53(TH) LED13.TH@54(TH) LED13.TH@55(TH) LED13.TH@56(TH) LED13.TH@57(TH) LED13.TH@58(TH) LED13.TH@59(TH) LED13.TH@60(TH) LED13.TH@61(TH) LED13.TH@62(TH) LED13.TH@63(TH) LED13.TH@64(TH) LED13.TH@65(TH) LED13.TH@66(TH) LED13.TH@67(TH) LED13.TH@69(TH) LED13.TH@70(TH) LED14.TH@38(TH) LED14.TH@39(TH) LED14.TH@40(TH) LED14.TH@41(TH) LED14.TH@42(TH) LED14.TH@43(TH) LED14.TH@44(TH) LED14.TH@45(TH) LED14.TH@46(TH) LED14.TH@47(TH) LED14.TH@48(TH) LED14.TH@49(TH) LED14.TH@50(TH) LED14.TH@51(TH) LED14.TH@52(TH) LED14.TH@53(TH) LED14.TH@54(TH) LED14.TH@55(TH) LED14.TH@56(TH) LED14.TH@57(TH) LED14.TH@58(TH) LED14.TH@59(TH) LED14.TH@60(TH) LED14.TH@61(TH) LED14.TH@62(TH) LED14.TH@63(TH) LED14.TH@64(TH) LED14.TH@65(TH) LED14.TH@66(TH) LED14.TH@67(TH) LED14.TH@69(TH) LED14.TH@70(TH) LED15.TH@38(TH) LED15.TH@39(TH) LED15.TH@40(TH) LED15.TH@41(TH) LED15.TH@42(TH) LED15.TH@43(TH) LED15.TH@44(TH) LED15.TH@45(TH) LED15.TH@46(TH) LED15.TH@47(TH) LED15.TH@48(TH) LED15.TH@49(TH) LED15.TH@50(TH) LED15.TH@51(TH) LED15.TH@52(TH) LED15.TH@53(TH) LED15.TH@54(TH) LED15.TH@55(TH) LED15.TH@56(TH) LED15.TH@57(TH) LED15.TH@58(TH) LED15.TH@59(TH) LED15.TH@60(TH) LED15.TH@61(TH) LED15.TH@62(TH) LED15.TH@63(TH) LED15.TH@64(TH) LED15.TH@65(TH) LED15.TH@66(TH) LED15.TH@67(TH) LED15.TH@69(TH) LED15.TH@70(TH) LED16.TH@38(TH) LED16.TH@39(TH) LED16.TH@40(TH) LED16.TH@41(TH) LED16.TH@42(TH) LED16.TH@43(TH) LED16.TH@44(TH) LED16.TH@45(TH) LED16.TH@46(TH) LED16.TH@47(TH) LED16.TH@48(TH) LED16.TH@49(TH) LED16.TH@50(TH) LED16.TH@51(TH) LED16.TH@52(TH) LED16.TH@53(TH) LED16.TH@54(TH) LED16.TH@55(TH) LED16.TH@56(TH) LED16.TH@57(TH) LED16.TH@58(TH) LED16.TH@59(TH) LED16.TH@60(TH) LED16.TH@61(TH) LED16.TH@62(TH) LED16.TH@63(TH) LED16.TH@64(TH) LED16.TH@65(TH) LED16.TH@66(TH) LED16.TH@67(TH) LED16.TH@69(TH) LED16.TH@70(TH) LED17.TH@38(TH) LED17.TH@39(TH) LED17.TH@40(TH) LED17.TH@41(TH) LED17.TH@42(TH) LED17.TH@43(TH) LED17.TH@44(TH) LED17.TH@45(TH) LED17.TH@46(TH) LED17.TH@47(TH) LED17.TH@48(TH) LED17.TH@49(TH) LED17.TH@50(TH) LED17.TH@51(TH) LED17.TH@52(TH) LED17.TH@53(TH) LED17.TH@54(TH) LED17.TH@55(TH) LED17.TH@56(TH) LED17.TH@57(TH) LED17.TH@58(TH) LED17.TH@59(TH) LED17.TH@60(TH) LED17.TH@61(TH) LED17.TH@62(TH) LED17.TH@63(TH) LED17.TH@64(TH) LED17.TH@65(TH) LED17.TH@66(TH) LED17.TH@67(TH) LED17.TH@68(TH) LED17.TH@69(TH) LED17.TH@70(TH) LED18.TH@38(TH) LED18.TH@39(TH) LED18.TH@40(TH) LED18.TH@41(TH) LED18.TH@42(TH) LED18.TH@43(TH) LED18.TH@44(TH) LED18.TH@45(TH) LED18.TH@46(TH) LED18.TH@47(TH) LED18.TH@48(TH) LED18.TH@49(TH) LED18.TH@50(TH) LED18.TH@51(TH) LED18.TH@52(TH) LED18.TH@53(TH) LED18.TH@54(TH) LED18.TH@55(TH) LED18.TH@56(TH) LED18.TH@57(TH) LED18.TH@58(TH) LED18.TH@59(TH) LED18.TH@60(TH) LED18.TH@61(TH) LED18.TH@62(TH) LED18.TH@63(TH) LED18.TH@64(TH) LED18.TH@65(TH) LED18.TH@66(TH) LED18.TH@67(TH) LED18.TH@68(TH) LED18.TH@69(TH) LED18.TH@70(TH) LED19.TH1(TH) LED19.TH@38(TH) LED19.TH@39(TH) LED19.TH@40(TH) LED19.TH@41(TH) LED19.TH@42(TH) LED19.TH@43(TH) LED19.TH@44(TH) LED19.TH@45(TH) LED19.TH@46(TH) LED19.TH@47(TH) LED19.TH@48(TH) LED19.TH@49(TH) LED19.TH@50(TH) LED19.TH@51(TH) LED19.TH@52(TH) LED19.TH@53(TH) LED19.TH@54(TH) LED19.TH@55(TH) LED19.TH@56(TH) LED19.TH@57(TH) LED19.TH@58(TH) LED19.TH@59(TH) LED19.TH@60(TH) LED19.TH@61(TH) LED19.TH@62(TH) LED19.TH@63(TH) LED19.TH@64(TH) LED19.TH@65(TH) LED19.TH@66(TH) LED19.TH@67(TH) LED19.TH@69(TH) LED19.TH@70(TH) LED20.TH1(TH) LED20.TH@38(TH) LED20.TH@39(TH) LED20.TH@40(TH) LED20.TH@41(TH) LED20.TH@42(TH) LED20.TH@43(TH) LED20.TH@44(TH) LED20.TH@45(TH) LED20.TH@46(TH) LED20.TH@47(TH) LED20.TH@48(TH) LED20.TH@49(TH) LED20.TH@50(TH) LED20.TH@51(TH) LED20.TH@52(TH) LED20.TH@53(TH) LED20.TH@54(TH) LED20.TH@55(TH) LED20.TH@56(TH) LED20.TH@57(TH) LED20.TH@58(TH) LED20.TH@59(TH) LED20.TH@60(TH) LED20.TH@61(TH) LED20.TH@62(TH) LED20.TH@63(TH) LED20.TH@64(TH) LED20.TH@65(TH) LED20.TH@66(TH) LED20.TH@67(TH) LED20.TH@69(TH) LED20.TH@70(TH) LED21.TH@38(TH) LED21.TH@39(TH) LED21.TH@40(TH) LED21.TH@41(TH) LED21.TH@42(TH) LED21.TH@43(TH) LED21.TH@44(TH) LED21.TH@45(TH) LED21.TH@46(TH) LED21.TH@47(TH) LED21.TH@48(TH) LED21.TH@49(TH) LED21.TH@50(TH) LED21.TH@51(TH) LED21.TH@52(TH) LED21.TH@53(TH) LED21.TH@54(TH) LED21.TH@55(TH) LED21.TH@56(TH) LED21.TH@57(TH) LED21.TH@58(TH) LED21.TH@59(TH) LED21.TH@60(TH) LED21.TH@61(TH) LED21.TH@62(TH) LED21.TH@63(TH) LED21.TH@64(TH) LED21.TH@65(TH) LED21.TH@66(TH) LED21.TH@67(TH) LED21.TH@69(TH) LED21.TH@70(TH) LED22.TH@38(TH) LED22.TH@39(TH) LED22.TH@40(TH) LED22.TH@41(TH) LED22.TH@42(TH) LED22.TH@43(TH) LED22.TH@44(TH) LED22.TH@45(TH) LED22.TH@46(TH) LED22.TH@47(TH) LED22.TH@48(TH) LED22.TH@49(TH) LED22.TH@50(TH) LED22.TH@51(TH) LED22.TH@52(TH) LED22.TH@53(TH) LED22.TH@54(TH) LED22.TH@55(TH) LED22.TH@56(TH) LED22.TH@57(TH) LED22.TH@58(TH) LED22.TH@59(TH) LED22.TH@60(TH) LED22.TH@61(TH) LED22.TH@62(TH) LED22.TH@63(TH) LED22.TH@64(TH) LED22.TH@65(TH) LED22.TH@66(TH) LED22.TH@67(TH) LED22.TH@69(TH) LED22.TH@70(TH) LED23.TH@38(TH) LED23.TH@39(TH) LED23.TH@40(TH) LED23.TH@41(TH) LED23.TH@42(TH) LED23.TH@43(TH) LED23.TH@44(TH) LED23.TH@45(TH) LED23.TH@46(TH) LED23.TH@47(TH) LED23.TH@48(TH) LED23.TH@49(TH) LED23.TH@50(TH) LED23.TH@51(TH) LED23.TH@52(TH) LED23.TH@53(TH) LED23.TH@54(TH) LED23.TH@55(TH) LED23.TH@56(TH) LED23.TH@57(TH) LED23.TH@58(TH) LED23.TH@59(TH) LED23.TH@60(TH) LED23.TH@61(TH) LED23.TH@62(TH) LED23.TH@63(TH) LED23.TH@64(TH) LED23.TH@65(TH) LED23.TH@66(TH) LED23.TH@67(TH) LED23.TH@69(TH) LED23.TH@70(TH) LED24.TH@38(TH) LED24.TH@39(TH) LED24.TH@40(TH) LED24.TH@41(TH) LED24.TH@42(TH) LED24.TH@43(TH) LED24.TH@44(TH) LED24.TH@45(TH) LED24.TH@46(TH) LED24.TH@47(TH) LED24.TH@48(TH) LED24.TH@49(TH) LED24.TH@50(TH) LED24.TH@51(TH) LED24.TH@52(TH) LED24.TH@53(TH) LED24.TH@54(TH) LED24.TH@55(TH) LED24.TH@56(TH) LED24.TH@57(TH) LED24.TH@58(TH) LED24.TH@59(TH) LED24.TH@60(TH) LED24.TH@61(TH) LED24.TH@62(TH) LED24.TH@63(TH) LED24.TH@64(TH) LED24.TH@65(TH) LED24.TH@66(TH) LED24.TH@67(TH) LED24.TH@69(TH) LED24.TH@70(TH) LED25.TH1(TH) LED25.TH@38(TH) LED25.TH@39(TH) LED25.TH@40(TH) LED25.TH@41(TH) LED25.TH@42(TH) LED25.TH@43(TH) LED25.TH@44(TH) LED25.TH@45(TH) LED25.TH@46(TH) LED25.TH@47(TH) LED25.TH@48(TH) LED25.TH@49(TH) LED25.TH@50(TH) LED25.TH@51(TH) LED25.TH@52(TH) LED25.TH@53(TH) LED25.TH@54(TH) LED25.TH@55(TH) LED25.TH@56(TH) LED25.TH@57(TH) LED25.TH@58(TH) LED25.TH@59(TH) LED25.TH@60(TH) LED25.TH@61(TH) LED25.TH@62(TH) LED25.TH@63(TH) LED25.TH@64(TH) LED25.TH@65(TH) LED25.TH@66(TH) LED25.TH@67(TH) LED25.TH@69(TH) LED25.TH@70(TH) LED26.TH1(TH) LED26.TH@38(TH) LED26.TH@39(TH) LED26.TH@40(TH) LED26.TH@41(TH) LED26.TH@42(TH) LED26.TH@43(TH) LED26.TH@44(TH) LED26.TH@45(TH) LED26.TH@46(TH) LED26.TH@47(TH) LED26.TH@48(TH) LED26.TH@49(TH) LED26.TH@50(TH) LED26.TH@51(TH) LED26.TH@52(TH) LED26.TH@53(TH) LED26.TH@54(TH) LED26.TH@55(TH) LED26.TH@56(TH) LED26.TH@57(TH) LED26.TH@58(TH) LED26.TH@59(TH) LED26.TH@60(TH) LED26.TH@61(TH) LED26.TH@62(TH) LED26.TH@63(TH) LED26.TH@64(TH) LED26.TH@65(TH) LED26.TH@66(TH) LED26.TH@67(TH) LED26.TH@69(TH) LED26.TH@70(TH) LED27.TH@38(TH) LED27.TH@39(TH) LED27.TH@40(TH) LED27.TH@41(TH) LED27.TH@42(TH) LED27.TH@43(TH) LED27.TH@44(TH) LED27.TH@45(TH) LED27.TH@46(TH) LED27.TH@47(TH) LED27.TH@48(TH) LED27.TH@49(TH) LED27.TH@50(TH) LED27.TH@51(TH) LED27.TH@52(TH) LED27.TH@53(TH) LED27.TH@54(TH) LED27.TH@55(TH) LED27.TH@56(TH) LED27.TH@57(TH) LED27.TH@58(TH) LED27.TH@59(TH) LED27.TH@60(TH) LED27.TH@61(TH) LED27.TH@62(TH) LED27.TH@63(TH) LED27.TH@64(TH) LED27.TH@65(TH) LED27.TH@66(TH) LED27.TH@67(TH) LED27.TH@68(TH) LED27.TH@69(TH) LED27.TH@70(TH) LED28.TH@38(TH) LED28.TH@39(TH) LED28.TH@40(TH) LED28.TH@41(TH) LED28.TH@42(TH) LED28.TH@43(TH) LED28.TH@44(TH) LED28.TH@45(TH) LED28.TH@46(TH) LED28.TH@47(TH) LED28.TH@48(TH) LED28.TH@49(TH) LED28.TH@50(TH) LED28.TH@51(TH) LED28.TH@52(TH) LED28.TH@53(TH) LED28.TH@54(TH) LED28.TH@55(TH) LED28.TH@56(TH) LED28.TH@57(TH) LED28.TH@58(TH) LED28.TH@59(TH) LED28.TH@60(TH) LED28.TH@61(TH) LED28.TH@62(TH) LED28.TH@63(TH) LED28.TH@64(TH) LED28.TH@65(TH) LED28.TH@66(TH) LED28.TH@67(TH) LED28.TH@68(TH) LED28.TH@69(TH) LED28.TH@70(TH) LED29.TH@38(TH) LED29.TH@39(TH) LED29.TH@40(TH) LED29.TH@41(TH) LED29.TH@42(TH) LED29.TH@43(TH) LED29.TH@44(TH) LED29.TH@45(TH) LED29.TH@46(TH) LED29.TH@47(TH) LED29.TH@48(TH) LED29.TH@49(TH) LED29.TH@50(TH) LED29.TH@51(TH) LED29.TH@52(TH) LED29.TH@53(TH) LED29.TH@54(TH) LED29.TH@55(TH) LED29.TH@56(TH) LED29.TH@57(TH) LED29.TH@58(TH) LED29.TH@59(TH) LED29.TH@60(TH) LED29.TH@61(TH) LED29.TH@62(TH) LED29.TH@63(TH) LED29.TH@64(TH) LED29.TH@65(TH) LED29.TH@66(TH) LED29.TH@67(TH) LED29.TH@69(TH) LED29.TH@70(TH) LED30.TH@38(TH) LED30.TH@39(TH) LED30.TH@40(TH) LED30.TH@41(TH) LED30.TH@42(TH) LED30.TH@43(TH) LED30.TH@44(TH) LED30.TH@45(TH) LED30.TH@46(TH) LED30.TH@47(TH) LED30.TH@48(TH) LED30.TH@49(TH) LED30.TH@50(TH) LED30.TH@51(TH) LED30.TH@52(TH) LED30.TH@53(TH) LED30.TH@54(TH) LED30.TH@55(TH) LED30.TH@56(TH) LED30.TH@57(TH) LED30.TH@58(TH) LED30.TH@59(TH) LED30.TH@60(TH) LED30.TH@61(TH) LED30.TH@62(TH) LED30.TH@63(TH) LED30.TH@64(TH) LED30.TH@65(TH) LED30.TH@66(TH) LED30.TH@67(TH) LED30.TH@69(TH) LED30.TH@70(TH) LED31.TH@38(TH) LED31.TH@39(TH) LED31.TH@40(TH) LED31.TH@41(TH) LED31.TH@42(TH) LED31.TH@43(TH) LED31.TH@44(TH) LED31.TH@45(TH) LED31.TH@46(TH) LED31.TH@47(TH) LED31.TH@48(TH) LED31.TH@49(TH) LED31.TH@50(TH) LED31.TH@51(TH) LED31.TH@52(TH) LED31.TH@53(TH) LED31.TH@54(TH) LED31.TH@55(TH) LED31.TH@56(TH) LED31.TH@57(TH) LED31.TH@58(TH) LED31.TH@59(TH) LED31.TH@60(TH) LED31.TH@61(TH) LED31.TH@62(TH) LED31.TH@63(TH) LED31.TH@64(TH) LED31.TH@65(TH) LED31.TH@66(TH) LED31.TH@67(TH) LED31.TH@69(TH) LED31.TH@70(TH) LED32.TH@38(TH) LED32.TH@39(TH) LED32.TH@40(TH) LED32.TH@41(TH) LED32.TH@42(TH) LED32.TH@43(TH) LED32.TH@44(TH) LED32.TH@45(TH) LED32.TH@46(TH) LED32.TH@47(TH) LED32.TH@48(TH) LED32.TH@49(TH) LED32.TH@50(TH) LED32.TH@51(TH) LED32.TH@52(TH) LED32.TH@53(TH) LED32.TH@54(TH) LED32.TH@55(TH) LED32.TH@56(TH) LED32.TH@57(TH) LED32.TH@58(TH) LED32.TH@59(TH) LED32.TH@60(TH) LED32.TH@61(TH) LED32.TH@62(TH) LED32.TH@63(TH) LED32.TH@64(TH) LED32.TH@65(TH) LED32.TH@66(TH) LED32.TH@67(TH) LED32.TH@69(TH) LED32.TH@70(TH) LED33.TH@38(TH) LED33.TH@39(TH) LED33.TH@40(TH) LED33.TH@41(TH) LED33.TH@42(TH) LED33.TH@43(TH) LED33.TH@44(TH) LED33.TH@45(TH) LED33.TH@46(TH) LED33.TH@47(TH) LED33.TH@48(TH) LED33.TH@49(TH) LED33.TH@50(TH) LED33.TH@51(TH) LED33.TH@52(TH) LED33.TH@53(TH) LED33.TH@54(TH) LED33.TH@55(TH) LED33.TH@56(TH) LED33.TH@57(TH) LED33.TH@58(TH) LED33.TH@59(TH) LED33.TH@60(TH) LED33.TH@61(TH) LED33.TH@62(TH) LED33.TH@63(TH) LED33.TH@64(TH) LED33.TH@65(TH) LED33.TH@66(TH) LED33.TH@67(TH) LED33.TH@68(TH) LED33.TH@69(TH) LED33.TH@70(TH) LED34.TH@38(TH) LED34.TH@39(TH) LED34.TH@40(TH) LED34.TH@41(TH) LED34.TH@42(TH) LED34.TH@43(TH) LED34.TH@44(TH) LED34.TH@45(TH) LED34.TH@46(TH) LED34.TH@47(TH) LED34.TH@48(TH) LED34.TH@49(TH) LED34.TH@50(TH) LED34.TH@51(TH) LED34.TH@52(TH) LED34.TH@53(TH) LED34.TH@54(TH) LED34.TH@55(TH) LED34.TH@56(TH) LED34.TH@57(TH) LED34.TH@58(TH) LED34.TH@59(TH) LED34.TH@60(TH) LED34.TH@61(TH) LED34.TH@62(TH) LED34.TH@63(TH) LED34.TH@64(TH) LED34.TH@65(TH) LED34.TH@66(TH) LED34.TH@67(TH) LED34.TH@68(TH) LED34.TH@69(TH) LED34.TH@70(TH) LED35.TH1(TH) LED35.TH@38(TH) LED35.TH@39(TH) LED35.TH@40(TH) LED35.TH@41(TH) LED35.TH@42(TH) LED35.TH@43(TH) LED35.TH@44(TH) LED35.TH@45(TH) LED35.TH@46(TH) LED35.TH@47(TH) LED35.TH@48(TH) LED35.TH@49(TH) LED35.TH@50(TH) LED35.TH@51(TH) LED35.TH@52(TH) LED35.TH@53(TH) LED35.TH@54(TH) LED35.TH@55(TH) LED35.TH@56(TH) LED35.TH@57(TH) LED35.TH@58(TH) LED35.TH@59(TH) LED35.TH@60(TH) LED35.TH@61(TH) LED35.TH@62(TH) LED35.TH@63(TH) LED35.TH@64(TH) LED35.TH@65(TH) LED35.TH@66(TH) LED35.TH@67(TH) LED35.TH@69(TH) LED35.TH@70(TH) LED36.TH1(TH) LED36.TH@38(TH) LED36.TH@39(TH) LED36.TH@40(TH) LED36.TH@41(TH) LED36.TH@42(TH) LED36.TH@43(TH) LED36.TH@44(TH) LED36.TH@45(TH) LED36.TH@46(TH) LED36.TH@47(TH) LED36.TH@48(TH) LED36.TH@49(TH) LED36.TH@50(TH) LED36.TH@51(TH) LED36.TH@52(TH) LED36.TH@53(TH) LED36.TH@54(TH) LED36.TH@55(TH) LED36.TH@56(TH) LED36.TH@57(TH) LED36.TH@58(TH) LED36.TH@59(TH) LED36.TH@60(TH) LED36.TH@61(TH) LED36.TH@62(TH) LED36.TH@63(TH) LED36.TH@64(TH) LED36.TH@65(TH) LED36.TH@66(TH) LED36.TH@67(TH) LED36.TH@69(TH) LED36.TH@70(TH) LED41.TH1(TH) LED41.TH@38(TH) LED41.TH@39(TH) LED41.TH@40(TH) LED41.TH@41(TH) LED41.TH@42(TH) LED41.TH@43(TH) LED41.TH@44(TH) LED41.TH@45(TH) LED41.TH@46(TH) LED41.TH@47(TH) LED41.TH@48(TH) LED41.TH@49(TH) LED41.TH@50(TH) LED41.TH@51(TH) LED41.TH@52(TH) LED41.TH@53(TH) LED41.TH@54(TH) LED41.TH@55(TH) LED41.TH@56(TH) LED41.TH@57(TH) LED41.TH@58(TH) LED41.TH@59(TH) LED41.TH@60(TH) LED41.TH@61(TH) LED41.TH@62(TH) LED41.TH@63(TH) LED41.TH@64(TH) LED41.TH@65(TH) LED41.TH@66(TH) LED41.TH@67(TH) LED41.TH@69(TH) LED41.TH@70(TH) LED42.TH1(TH) LED42.TH@38(TH) LED42.TH@39(TH) LED42.TH@40(TH) LED42.TH@41(TH) LED42.TH@42(TH) LED42.TH@43(TH) LED42.TH@44(TH) LED42.TH@45(TH) LED42.TH@46(TH) LED42.TH@47(TH) LED42.TH@48(TH) LED42.TH@49(TH) LED42.TH@50(TH) LED42.TH@51(TH) LED42.TH@52(TH) LED42.TH@53(TH) LED42.TH@54(TH) LED42.TH@55(TH) LED42.TH@56(TH) LED42.TH@57(TH) LED42.TH@58(TH) LED42.TH@59(TH) LED42.TH@60(TH) LED42.TH@61(TH) LED42.TH@62(TH) LED42.TH@63(TH) LED42.TH@64(TH) LED42.TH@65(TH) LED42.TH@66(TH) LED42.TH@67(TH) LED42.TH@69(TH) LED42.TH@70(TH) LED43.TH@38(TH) LED43.TH@39(TH) LED43.TH@40(TH) LED43.TH@41(TH) LED43.TH@42(TH) LED43.TH@43(TH) LED43.TH@44(TH) LED43.TH@45(TH) LED43.TH@46(TH) LED43.TH@47(TH) LED43.TH@48(TH) LED43.TH@49(TH) LED43.TH@50(TH) LED43.TH@51(TH) LED43.TH@52(TH) LED43.TH@53(TH) LED43.TH@54(TH) LED43.TH@55(TH) LED43.TH@56(TH) LED43.TH@57(TH) LED43.TH@58(TH) LED43.TH@59(TH) LED43.TH@60(TH) LED43.TH@61(TH) LED43.TH@62(TH) LED43.TH@63(TH) LED43.TH@64(TH) LED43.TH@65(TH) LED43.TH@66(TH) LED43.TH@67(TH) LED43.TH@68(TH) LED43.TH@69(TH) LED43.TH@70(TH) LED44.TH@38(TH) LED44.TH@39(TH) LED44.TH@40(TH) LED44.TH@41(TH) LED44.TH@42(TH) LED44.TH@43(TH) LED44.TH@44(TH) LED44.TH@45(TH) LED44.TH@46(TH) LED44.TH@47(TH) LED44.TH@48(TH) LED44.TH@49(TH) LED44.TH@50(TH) LED44.TH@51(TH) LED44.TH@52(TH) LED44.TH@53(TH) LED44.TH@54(TH) LED44.TH@55(TH) LED44.TH@56(TH) LED44.TH@57(TH) LED44.TH@58(TH) LED44.TH@59(TH) LED44.TH@60(TH) LED44.TH@61(TH) LED44.TH@62(TH) LED44.TH@63(TH) LED44.TH@64(TH) LED44.TH@65(TH) LED44.TH@66(TH) LED44.TH@67(TH) LED44.TH@68(TH) LED44.TH@69(TH) LED44.TH@70(TH) LED49.TH@38(TH) LED49.TH@39(TH) LED49.TH@40(TH) LED49.TH@41(TH) LED49.TH@42(TH) LED49.TH@43(TH) LED49.TH@44(TH) LED49.TH@45(TH) LED49.TH@46(TH) LED49.TH@47(TH) LED49.TH@48(TH) LED49.TH@49(TH) LED49.TH@50(TH) LED49.TH@51(TH) LED49.TH@52(TH) LED49.TH@53(TH) LED49.TH@54(TH) LED49.TH@55(TH) LED49.TH@56(TH) LED49.TH@57(TH) LED49.TH@58(TH) LED49.TH@59(TH) LED49.TH@60(TH) LED49.TH@61(TH) LED49.TH@62(TH) LED49.TH@63(TH) LED49.TH@64(TH) LED49.TH@65(TH) LED49.TH@66(TH) LED49.TH@67(TH) LED49.TH@68(TH) LED49.TH@69(TH) LED49.TH@70(TH) LED50.TH@38(TH) LED50.TH@39(TH) LED50.TH@40(TH) LED50.TH@41(TH) LED50.TH@42(TH) LED50.TH@43(TH) LED50.TH@44(TH) LED50.TH@45(TH) LED50.TH@46(TH) LED50.TH@47(TH) LED50.TH@48(TH) LED50.TH@49(TH) LED50.TH@50(TH) LED50.TH@51(TH) LED50.TH@52(TH) LED50.TH@53(TH) LED50.TH@54(TH) LED50.TH@55(TH) LED50.TH@56(TH) LED50.TH@57(TH) LED50.TH@58(TH) LED50.TH@59(TH) LED50.TH@60(TH) LED50.TH@61(TH) LED50.TH@62(TH) LED50.TH@63(TH) LED50.TH@64(TH) LED50.TH@65(TH) LED50.TH@66(TH) LED50.TH@67(TH) LED50.TH@68(TH) LED50.TH@69(TH) LED50.TH@70(TH) LED51.TH1(TH) LED51.TH@38(TH) LED51.TH@39(TH) LED51.TH@40(TH) LED51.TH@41(TH) LED51.TH@42(TH) LED51.TH@43(TH) LED51.TH@44(TH) LED51.TH@45(TH) LED51.TH@46(TH) LED51.TH@47(TH) LED51.TH@48(TH) LED51.TH@49(TH) LED51.TH@50(TH) LED51.TH@51(TH) LED51.TH@52(TH) LED51.TH@53(TH) LED51.TH@54(TH) LED51.TH@55(TH) LED51.TH@56(TH) LED51.TH@57(TH) LED51.TH@58(TH) LED51.TH@59(TH) LED51.TH@60(TH) LED51.TH@61(TH) LED51.TH@62(TH) LED51.TH@63(TH) LED51.TH@64(TH) LED51.TH@65(TH) LED51.TH@66(TH) LED51.TH@67(TH) LED51.TH@69(TH) LED51.TH@70(TH) LED52.TH1(TH) LED52.TH@38(TH) LED52.TH@39(TH) LED52.TH@40(TH) LED52.TH@41(TH) LED52.TH@42(TH) LED52.TH@43(TH) LED52.TH@44(TH) LED52.TH@45(TH) LED52.TH@46(TH) LED52.TH@47(TH) LED52.TH@48(TH) LED52.TH@49(TH) LED52.TH@50(TH) LED52.TH@51(TH) LED52.TH@52(TH) LED52.TH@53(TH) LED52.TH@54(TH) LED52.TH@55(TH) LED52.TH@56(TH) LED52.TH@57(TH) LED52.TH@58(TH) LED52.TH@59(TH) LED52.TH@60(TH) LED52.TH@61(TH) LED52.TH@62(TH) LED52.TH@63(TH) LED52.TH@64(TH) LED52.TH@65(TH) LED52.TH@66(TH) LED52.TH@67(TH) LED52.TH@69(TH) LED52.TH@70(TH) LED57.TH1(TH) LED57.TH@38(TH) LED57.TH@39(TH) LED57.TH@40(TH) LED57.TH@41(TH) LED57.TH@42(TH) LED57.TH@43(TH) LED57.TH@44(TH) LED57.TH@45(TH) LED57.TH@46(TH) LED57.TH@47(TH) LED57.TH@48(TH) LED57.TH@49(TH) LED57.TH@50(TH) LED57.TH@51(TH) LED57.TH@52(TH) LED57.TH@53(TH) LED57.TH@54(TH) LED57.TH@55(TH) LED57.TH@56(TH) LED57.TH@57(TH) LED57.TH@58(TH) LED57.TH@59(TH) LED57.TH@60(TH) LED57.TH@61(TH) LED57.TH@62(TH) LED57.TH@63(TH) LED57.TH@64(TH) LED57.TH@65(TH) LED57.TH@66(TH) LED57.TH@67(TH) LED57.TH@69(TH) LED57.TH@70(TH) LED58.TH1(TH) LED58.TH@38(TH) LED58.TH@39(TH) LED58.TH@40(TH) LED58.TH@41(TH) LED58.TH@42(TH) LED58.TH@43(TH) LED58.TH@44(TH) LED58.TH@45(TH) LED58.TH@46(TH) LED58.TH@47(TH) LED58.TH@48(TH) LED58.TH@49(TH) LED58.TH@50(TH) LED58.TH@51(TH) LED58.TH@52(TH) LED58.TH@53(TH) LED58.TH@54(TH) LED58.TH@55(TH) LED58.TH@56(TH) LED58.TH@57(TH) LED58.TH@58(TH) LED58.TH@59(TH) LED58.TH@60(TH) LED58.TH@61(TH) LED58.TH@62(TH) LED58.TH@63(TH) LED58.TH@64(TH) LED58.TH@65(TH) LED58.TH@66(TH) LED58.TH@67(TH) LED58.TH@69(TH) LED58.TH@70(TH) LED59.TH@38(TH) LED59.TH@39(TH) LED59.TH@40(TH) LED59.TH@41(TH) LED59.TH@42(TH) LED59.TH@43(TH) LED59.TH@44(TH) LED59.TH@45(TH) LED59.TH@46(TH) LED59.TH@47(TH) LED59.TH@48(TH) LED59.TH@49(TH) LED59.TH@50(TH) LED59.TH@51(TH) LED59.TH@52(TH) LED59.TH@53(TH) LED59.TH@54(TH) LED59.TH@55(TH) LED59.TH@56(TH) LED59.TH@57(TH) LED59.TH@58(TH) LED59.TH@59(TH) LED59.TH@60(TH) LED59.TH@61(TH) LED59.TH@62(TH) LED59.TH@63(TH) LED59.TH@64(TH) LED59.TH@65(TH) LED59.TH@66(TH) LED59.TH@67(TH) LED59.TH@68(TH) LED59.TH@69(TH) LED59.TH@70(TH) LED60.TH1(TH) LED60.TH@38(TH) LED60.TH@39(TH) LED60.TH@40(TH) LED60.TH@41(TH) LED60.TH@42(TH) LED60.TH@43(TH) LED60.TH@44(TH) LED60.TH@45(TH) LED60.TH@46(TH) LED60.TH@47(TH) LED60.TH@48(TH) LED60.TH@49(TH) LED60.TH@50(TH) LED60.TH@51(TH) LED60.TH@52(TH) LED60.TH@53(TH) LED60.TH@54(TH) LED60.TH@55(TH) LED60.TH@56(TH) LED60.TH@57(TH) LED60.TH@58(TH) LED60.TH@59(TH) LED60.TH@60(TH) LED60.TH@61(TH) LED60.TH@62(TH) LED60.TH@63(TH) LED60.TH@64(TH) LED60.TH@65(TH) LED60.TH@66(TH) LED60.TH@67(TH) LED60.TH@68(TH) LED60.TH@69(TH) LED60.TH@70(TH)

## Library data of the parts
C1-C6 C8-C23 = STEVES_BU:CAPS
C7 = SparkFun:CAP_POL: Capacitor Polarized These are standard SMD and PTH capacitors. Normally 10uF, 47uF, and 100uF in electrolytic and tantalum varieties. Always verify the external diameter of the through hole cap, it varies with capacity, voltage, and manufacturer. The EIA devices should be standard.
D1 D2 D83 D196 = STEVES_BU:DIODE_SCHOTTKY
D3-D82 D84-D195 D197-D260 = STEVES_BU:LED
FID1-FID3 = SparkFun:FIDUCIAL: Fiducial Alignment Points Various fiducial points for machine vision alignment.
J1 = STEVES_BU:CON8
J2 = STEVES_BU:CON2
JP1 = SparkFun:M05X2: Header 5x2 Standard 10-pin dual row 0.1" header. Commonly used with AVR-ISP. Use with Spark Fun Electronics SKU: PRT-00778
L1-L4 = STEVES_BU:INDUCTOR_SM
LED1-LED64 = STEVES_BU:REBEL_0603
Q1-Q4 Q10 Q11 Q13 Q14 = STEVES_BU:MOSFET-N
Q5 Q6 Q8 Q9 Q12 = STEVES1:MOSFET-N
Q7 = transistor-fet:MOSFET-P
R1-R4 R40 R50 R57 R67 = STEVES_BU:RESISTOR-POWER
R5 R6 R18 R24 R26 R27 R30-R34 = STEVES:RESISTOR_SM
R7-R17 R19-R23 R25 R28 R29 R35-R39 R41-R49 R51-R56 R58-R66 R68 = STEVES_BU:RESISTOR_SM
U1-U5 U8 U15 U17 U18 U20 = analog-devices:AD8065: High Performance, 145 MHz FastFET Op Amps Source: http://www.analog.com/static/imported-files/data_sheets/AD8065_8066.pdf; MF: ALTERA CORPORATION; MPN: AD8065ARTZ-REEL7; OC_FARNELL: 1464845; OC_NEWARK: 59K6316
U6 U7 U16 U19 = STEVES_BU:AD8807
U9 U14 = STEVES_BU:LM26
U10 U12 = STEVES_BU:74DUAL14
U11 = maxim:MAX9064
U13 = linear:78*: Positive VOLTAGE REGULATOR Source: http://cache.national.com/ds/LM/LM78L05.pdf http://www.fairchildsemi.com/ds/LM/LM7805.pdf